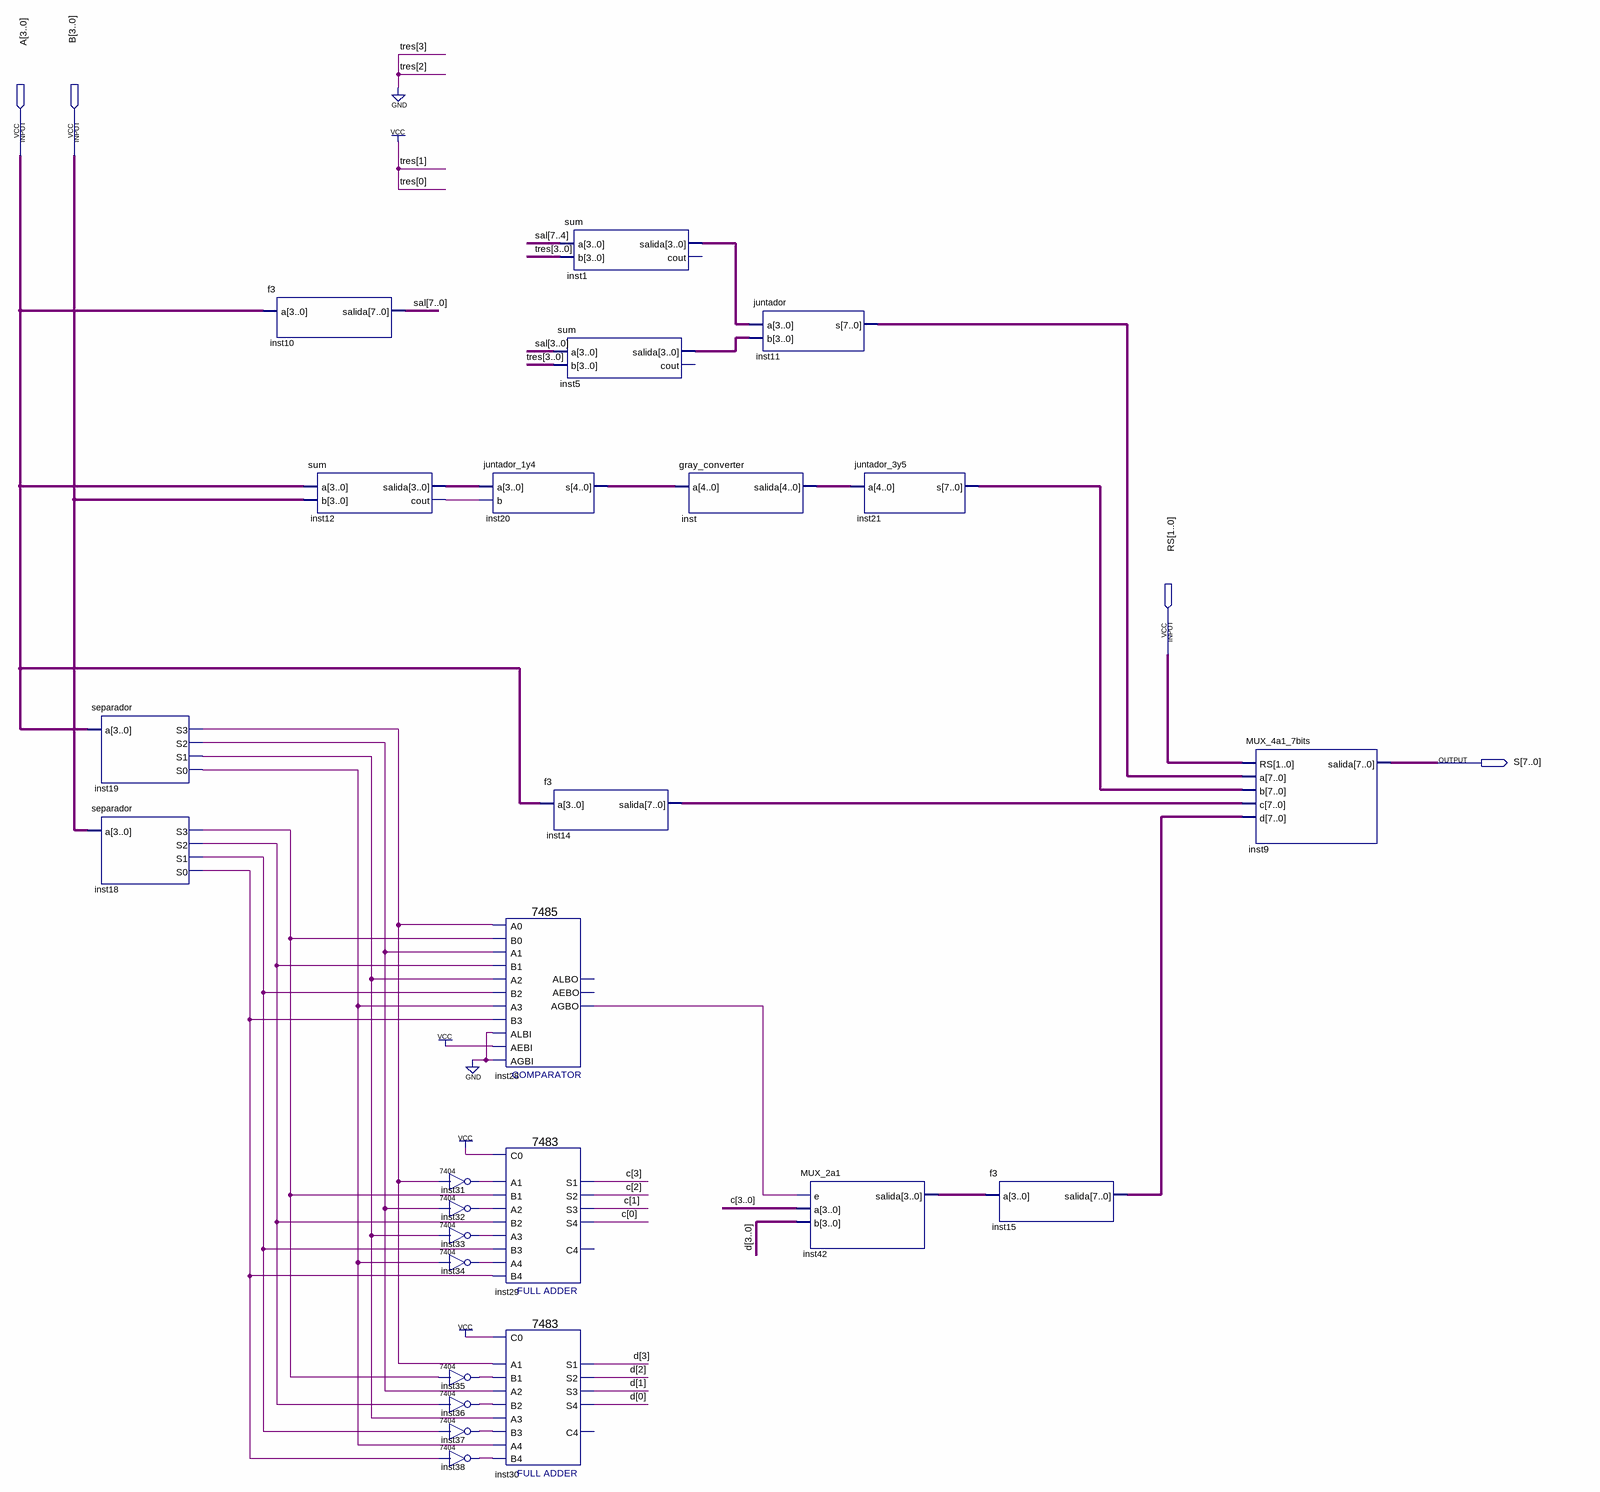
[diagram p0: schematic sheet]
// Quartus schematic Circuito.bdf as structural Verilog: 25 symbols, 4 pins
module Circuito (
  input  [3:0] A,
  input  [3:0] B,
  input  [1:0] RS,
  output [7:0] S
);

  wire inst12_cout, inst18_s0, inst18_s1, inst18_s2, inst18_s3, inst19_s0, inst19_s1, inst19_s2, inst19_s3,
       inst28_agbo, inst31_1, inst32_1, inst33_1, inst34_1, inst35_1, inst36_1, inst37_1, inst38_1;
  wire [3:0] c, d, inst1_salida, inst5_salida, inst12_salida, inst42_salida;
  wire [4:0] inst20_s, inst_salida;
  wire [7:0] inst11_s, inst14_salida, inst15_salida, inst21_s, sal;

  separador inst19 (.a(A), .S3(inst19_s3), .S2(inst19_s2), .S1(inst19_s1), .S0(inst19_s0));
  separador inst18 (.a(B), .S3(inst18_s3), .S2(inst18_s2), .S1(inst18_s1), .S0(inst18_s0));
  f3 inst10 (.a(A), .salida(sal));
  sum inst12 (.a(A), .b(B), .salida(inst12_salida), .cout(inst12_cout));
  \7404  inst31 (.\2 (inst19_s3), .\1 (inst31_1));
  \7404  inst32 (.\2 (inst19_s2), .\1 (inst32_1));
  \7404  inst33 (.\2 (inst19_s1), .\1 (inst33_1));
  \7404  inst34 (.\2 (inst19_s0), .\1 (inst34_1));
  \7404  inst35 (.\2 (inst18_s3), .\1 (inst35_1));
  \7404  inst36 (.\2 (inst18_s2), .\1 (inst36_1));
  \7404  inst37 (.\2 (inst18_s1), .\1 (inst37_1));
  \7404  inst38 (.\2 (inst18_s0), .\1 (inst38_1));
  juntador_1y4 inst20 (.a(inst12_salida), .b(inst12_cout), .s(inst20_s));
  \7485  inst28 (
    .A3(inst19_s0), .B2(inst18_s1), .A2(inst19_s1), .AEBI(1'b1), .AGBI(1'b0), .ALBI(1'b0), .A0(inst19_s3),
    .B0(inst18_s3), .B3(inst18_s0), .A1(inst19_s2), .B1(inst18_s2), .AGBO(inst28_agbo));  // open: ALBO, AEBO
  \7483  inst29 (
    .B4(inst18_s0), .C0(1'b1), .A1(inst31_1), .A2(inst32_1), .B1(inst18_s3), .B2(inst18_s2), .A3(inst33_1),
    .B3(inst18_s1), .A4(inst34_1), .S3(c[1]), .S4(c[0]), .S2(c[2]), .S1(c[3]));  // open: C4
  \7483  inst30 (
    .B4(inst38_1), .C0(1'b1), .A1(inst19_s3), .A2(inst19_s2), .B1(inst35_1), .B2(inst36_1), .A3(inst19_s1),
    .B3(inst37_1), .A4(inst19_s0), .S3(d[1]), .S4(d[0]), .S2(d[2]), .S1(d[3]));  // open: C4
  sum inst1 (.a(sal[7:4]), .b(4'b0011), .salida(inst1_salida));  // open: cout
  sum inst5 (.a(sal[3:0]), .b(4'b0011), .salida(inst5_salida));  // open: cout
  f3 inst14 (.a(A), .salida(inst14_salida));
  gray_converter inst (.a(inst20_s), .salida(inst_salida));
  juntador inst11 (.a(inst1_salida), .b(inst5_salida), .s(inst11_s));
  MUX_2a1 inst42 (.e(inst28_agbo), .a(c), .b(d), .salida(inst42_salida));
  juntador_3y5 inst21 (.a(inst_salida), .s(inst21_s));
  f3 inst15 (.a(inst42_salida), .salida(inst15_salida));
  MUX_4a1_7bits inst9 (.RS(RS), .a(inst11_s), .b(inst21_s), .c(inst14_salida), .d(inst15_salida), .salida(S));
endmodule
